# EAGLE design *Rangefinder (EAGLE 7.2.0)
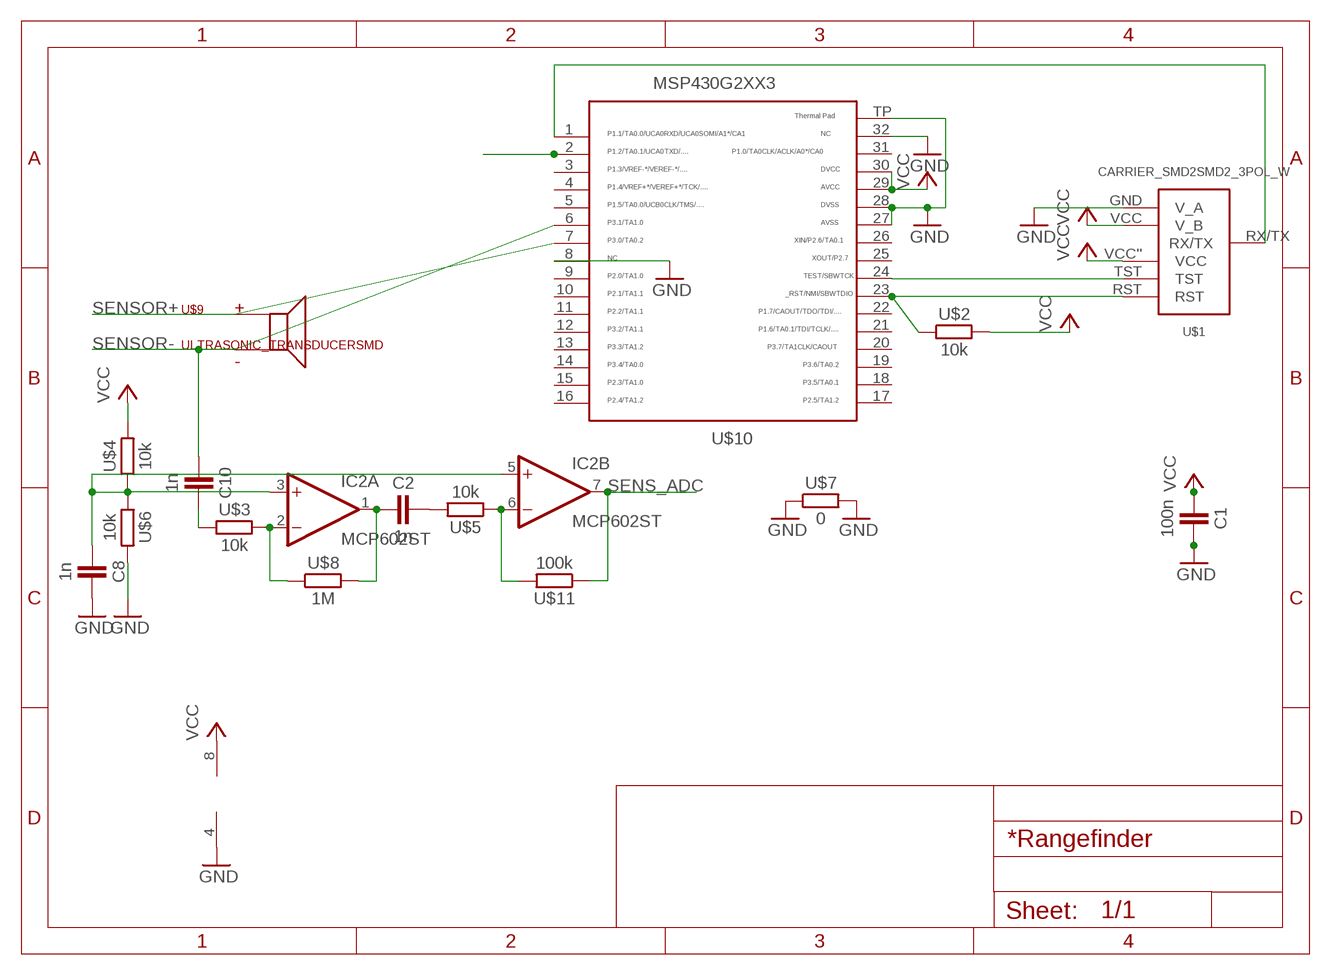
[diagram p0: schematic, sheet 1]

## Parts
C1  100n  CAPACITOR  [603]
C2  1n  CAPACITOR  [603]
C8  1n  CAPACITOR  [603]
C10  1n  CAPACITOR  [603]
IC2  MCP602ST  [TSSOP8]
U$1  CARRIER_SMD2SMD2_3POL_W  [CARRIER_SMD2_WIDE_3POL]
U$2  10k  RESISTOR0603  [603]
U$3  10k  RESISTOR0603  [603]
U$4  10k  RESISTOR0603  [603]
U$5  10k  RESISTOR0603  [603]
U$6  10k  RESISTOR0603  [603]
U$7  0  RESISTOR0603  [603]
U$8  1M  RESISTOR0603  [603]
U$9  ULTRASONIC_TRANSDUCERSMD  [TRANSDUCER2]
U$10  MSP430G2553  [QFN32]
U$11  100k  RESISTOR0603  [603]

## Nets
GND: C1.2 C8.2 IC2.4(P:V-) U$1.GND(V_A) U$6.2 U$7.1 U$7.2 U$10.8 U$10.27 U$10.28 U$10.32 U$10.TP
N$2: C10.2 U$3.1
N$3: U$1.TST U$10.24
N$4: U$1.RST U$2.1 U$10.23
N$5: C2.2 U$5.2
N$6: IC2.6(B:-IN) U$5.1 U$11.2
N$12: U$1.RX/TX U$10.1
N$38: C8.1 IC2.3(A:+IN) IC2.5(B:+IN) U$4.1 U$6.1
N$41: IC2.2(A:-IN) U$3.2 U$8.1
N$43: C2.1 IC2.1(A:OUT) U$8.2
SENS_ADC: IC2.7(B:OUT) U$10.2 U$11.1
SENSOR+: U$9.P$3 U$10.7
SENSOR-: C10.1 U$9.P$4 U$10.6
VCC: C1.1 IC2.8(P:V+) U$1.VCC''(VCC) U$1.VCC(V_B) U$2.2 U$4.2 U$10.29 U$10.30
Unconnected: U$10.3 U$10.4 U$10.5 U$10.9 U$10.10 U$10.11 U$10.12 U$10.13 U$10.14 U$10.15 U$10.16 U$10.17 U$10.18 U$10.19 U$10.20 U$10.21 U$10.22 U$10.25 U$10.26 U$10.31

## Library data of the parts
C1 C2 C8 C10 = thar:CAPACITOR
IC2 = linear:MCP602: Single Op Amp 2.7V to 6.0V Single Supply CMOS Source: http://ww1.microchip.com/downloads/en/DeviceDoc/21314g.pdf
U$1 = thar:CARRIER_SMD2
U$2-U$8 U$11 = thar:RESISTOR
U$9 = thar:ULTRASONIC_TRANSDUCER
U$10 = thar:MSP430G2553: TEXAS INSTRUMENTS MSP430G2553IRHB32R MCU, 16BIT, MSP430, 16MHZ, QFN-32 Farnell Best.Nr.: 2325726 Herst.Bez.: MSP430G2553IRHB32R

## Board
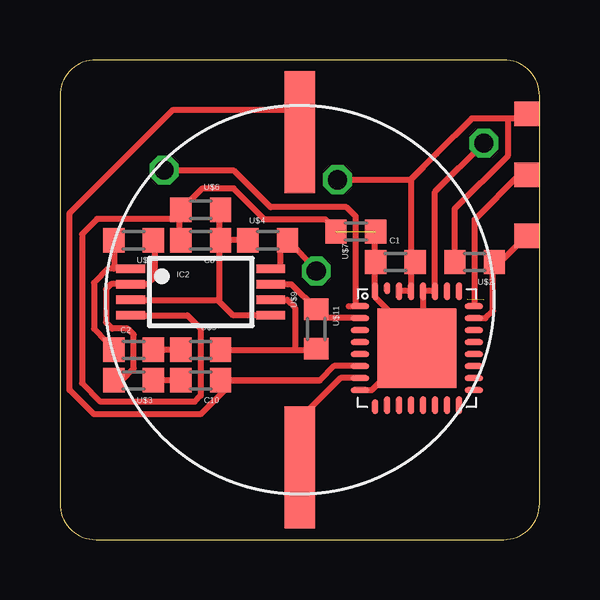
[diagram p1: board, top side]
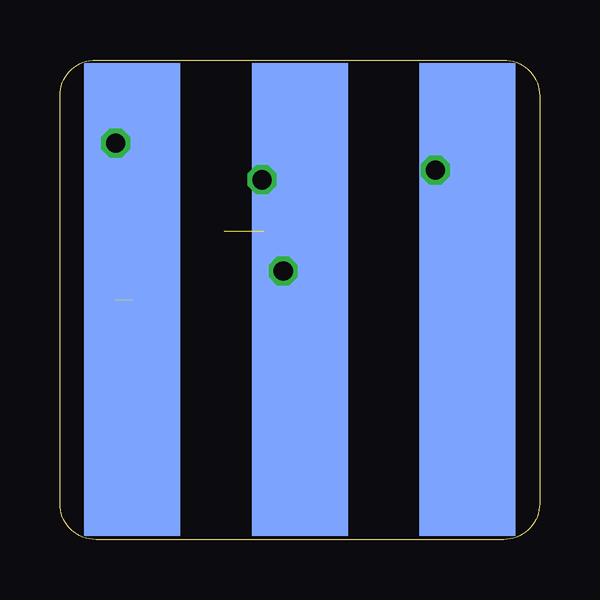
[diagram p2: board, bottom side, seen from below]

Size 20 x 20 mm. Coordinates in mm from the lower left corner, seen from the top.
Copper layers (1*16): Top 0.035mm / dielectric 1.5mm / Bottom 0.035mm
Design rules "Bilex DRU *": minimum track width 10mil, minimum drill 24mil, track to track 10mil, track to pad 10mil, pad to pad 10mil, via to via 10mil, smd to smd 10mil, copper to edge 1mil, drill to drill 8mil, minimum pad ring 10mil, minimum via ring 8mil, stop-mask expansion 4mil, vias tented up to drill 0mil, thermal gap 10mil

### Footprints (pad centres in the part's own frame; a part is rotated, then mirrored left to right if it is on the bottom)
603 = smd 0.889 x 1.016: 1 -0.826,0; 2 0.826,0
TSSOP8 = smd 0.35 x 1.2: 1 -0.975,-2.925; 2 -0.325,-2.925; 3 0.325,-2.925; 4 0.975,-2.925; 5 0.975,2.925; 6 0.325,2.925; 7 -0.325,2.925; 8 -0.975,2.925
CARRIER_SMD2_WIDE_3POL = smd 4 x 19.7 bottom: GND -6.985,3.493; RX/TX 6.985,3.493; VCC 0,3.493 | smd 1.016 x 1.016: RST -9.461,0.826; TST -9.461,-1.714; VCC'' -9.461,-4.255
TRANSDUCER2 = smd 5.08 x 1.27: P$3 -6.985,0; P$4 6.985,0
QFN32 = smd 0.762 x 0.254: 1 -2.375,1.75; 2 -2.375,1.25; 3 -2.375,0.75; 4 -2.375,0.25; 5 -2.375,-0.25; 6 -2.375,-0.75; 7 -2.375,-1.25; 8 -2.375,-1.75; 17 2.375,-1.75; 18 2.375,-1.25; 19 2.375,-0.75; 20 2.375,-0.25; 21 2.375,0.25; 22 2.375,0.75; 23 2.375,1.25; 24 2.375,1.75 | smd 0.254 x 0.635: 9 -1.75,-2.438 | smd 0.254 x 0.762: 10 -1.25,-2.375; 11 -0.75,-2.375; 12 -0.25,-2.375; 13 0.25,-2.375; 14 0.75,-2.375; 15 1.25,-2.375; 16 1.75,-2.375; 25 1.75,2.375; 26 1.25,2.375; 27 0.75,2.375; 28 0.25,2.375; 29 -0.25,2.375; 30 -0.75,2.375; 32 -1.75,2.375 | smd 0.254 x 0.508: 31 -1.25,2.5 | smd 3.302 x 3.302: TP 0,0

### Placement (x,y rotation side)
C1  13.99,11.57 180 top
C2  3.08,7.91 0 top
C8  5.87,12.48 180 top
C10  5.87,6.64 180 top
IC2  5.87,10.32 270 top
U$1  10,13.5 180 top
U$2  17.29,11.57 180 top
U$3  3.08,6.64 180 top
U$4  8.66,12.48 0 top
U$5  5.87,7.91 180 top
U$6  5.87,13.75 180 top
U$7  12.34,12.84 180 top
U$8  3.08,12.48 180 top
U$9  10,10 90 top
U$10  14.89,7.98 0 top
U$11  10.69,8.78 270 top

### Tracks (layer width: path | path; a pad name or v marks a point on that pad's centre or on a via)
GND  (via drill 0.8)  (2 unrouted)
  Top 0.254: 15.41,8.3 15.17,9.33 15.15,9.31 | 15.41,8.3 15.46,7.02 U$10.TP 14,6.89 13.87,7.09 13.01,6.23 U$10.8 | 15.14,8.67 U$10.28 U$10.27 15.64,14.5 v17.67,16.53 | 15.14,8.67 15.14,8.37 15.41,8.3 | 15.14,8.67 14.5,9.31 13.74,9.51 13.14,10.11 U$10.32 13.14,11.73 | 4.98,12.86 5.04,12.8 C8.2 5.04,12.67 4.98,12.73 4.98,12.86 | 4.98,12.86 4.98,13.37 | 4.98,13.37 4.98,13.69 U$6.2 5.93,14.64 7.24,14.64 8.53,13.35 11.07,13.35 11.2,13.22 11.45,13.22 11.51,13.16 U$7.2 | 4.98,13.37 1.55,13.37 0.92,12.73 0.92,6.51 1.68,5.75 5.62,5.75 5.87,6 5.87,8.8 5.32,9.35 IC2.4 | 13.14,11.73 C1.2 13.1,11.57 | 13.14,11.73 13.14,12.82 U$7.1
  Bottom 0.254: v17.67,16.53 17.68,10.64 | 17.68,10.64 18,10.83 | 17.68,10.64 17.67,10.64 v17.67,16.53 | 18,10 17.67,10 v17.67,16.53
N$2
  Top 0.254: C10.2 U$3.1
N$3
  Top 0.254: U$10.24 17.26,9.77 17.29,9.79 17.29,13.35 19.2,15.26 19.42,15.26 U$1.TST
N$4
  Top 0.254: U$10.23 17.75,9.23 18.05,9.54 18.05,11.38 U$2.1 18.36,11.57 U$1.RST
N$5
  Top 0.254: U$5.2 C2.2
N$6
  Top 0.254: U$5.1 9.8,7.91 | IC2.6 9.47,10 9.8,9.67 9.8,7.91 | 9.8,7.91 10.69,7.91 U$11.2
N$12  (via drill 0.8)
  Top 0.254: U$10.1 12.28,9.73 | 12.05,9.73 12.28,9.73 | 12.28,9.73 12.34,9.79 12.34,13.48 11.96,13.86 8.78,13.86 7.26,15.38 4.37,15.38 v4.35,15.4
  Bottom 0.254: v4.35,15.4 3.01,12.04 U$1.RX/TX
N$38
  Top 0.254: 6.63,12.16 C8.1 | IC2.3 6.58,10 | 6.63,12.16 6.7,12.29 6.76,12.48 | U$6.1 6.63,13.75 6.63,12.48 C8.1 | 6.63,12.16 6.63,10 6.58,10 | IC2.5 7.23,9.35 6.58,10 | U$4.1 6.76,12.48 | 6.76,12.48 C8.1
N$41
  Top 0.254: U$8.1 3.96,12.29 3.96,10.96 3.66,10.65 IC2.2 2.13,10.65 1.92,10.44 1.92,9.06 2.19,8.8 2.82,8.8 3.08,8.54 3.08,7.15 2.57,6.64 U$3.2
N$43
  Top 0.254: IC2.1 2.25,11.3 | C2.1 2.31,8.29 1.93,8.29 1.42,8.8 1.42,10.7 2.02,11.3 2.25,11.3 | U$8.2 2.25,11.3
SENS_ADC
  Top 0.254: U$10.2 11.06,9.23 U$11.1 9.65,10.65 IC2.7
SENSOR+
  Top 0.254: U$10.7 11.69,6.73 10.25,5.3 U$9.P$3
SENSOR-
  Top 0.254: 10.83,6.64 C10.1 | U$10.6 11.43,7.23 10.83,6.64 | 10.83,6.64 10.81,6.62 7.01,6.62 6.88,6.49 6.88,6.24 5.86,5.22 1.42,5.22 0.4,6.24 0.4,13.61 4.72,17.92 10.18,17.92 10.25,17.85 U$9.P$4
VCC  (via drill 0.8)
  Top 0.254: U$10.29 | 14.63,11.57 U$10.29 | U$10.29 U$10.30 | U$4.2 9.17,12.48 9.17,11.3 IC2.8 | U$4.2 9.54,12.48 9.67,12.46 9.67,12.34 v10.69,11.19 | 18.69,17.56 19.39,17.56 U$1.VCC'' | 18.69,17.56 17.17,17.56 15.7,16.09 | 15.7,16.09 14.63,15.02 14.63,11.57 | C1.1 14.63,11.57 | U$2.2 16.47,13.8 18.69,16.02 18.69,17.56 | v11.58,15 14.62,15 15.7,16.09 | 9.51,12.46 U$4.2
  Bottom 0.254: U$1.VCC 10,11.75 | v11.58,15 10,13.17 10,11.75 | 10,11.75 v10.69,11.19